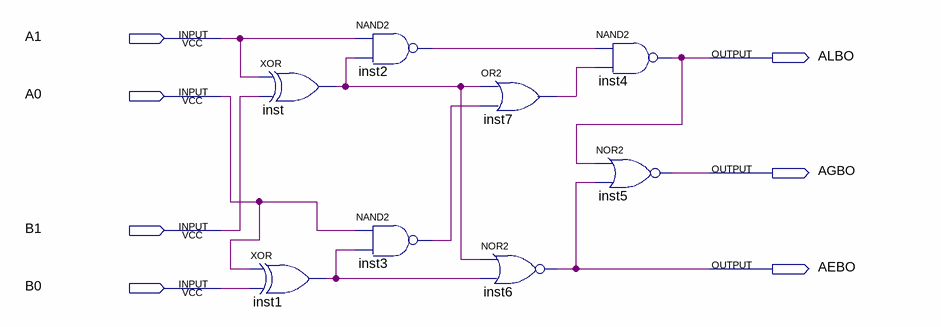
[diagram p0: schematic sheet]
// Quartus schematic Block2.bdf as structural Verilog: 8 symbols, 7 pins
module Block2 (
  input  A1,
  input  A0,
  input  B1,
  input  B0,
  output ALBO,
  output AGBO,
  output AEBO
);

  wire inst1_out, inst2_out, inst3_out, inst7_out, inst_out;

  xor inst (inst_out, A1, B1);
  xor inst1 (inst1_out, A0, B0);
  nand inst2 (inst2_out, A1, inst_out);
  nand inst3 (inst3_out, A0, inst1_out);
  or inst7 (inst7_out, inst_out, inst3_out);
  nor inst6 (AEBO, inst_out, inst1_out);
  nand inst4 (ALBO, inst2_out, inst7_out);
  nor inst5 (AGBO, ALBO, AEBO);
endmodule
